# EAGLE design accel-chain (EAGLE 6.5.0)
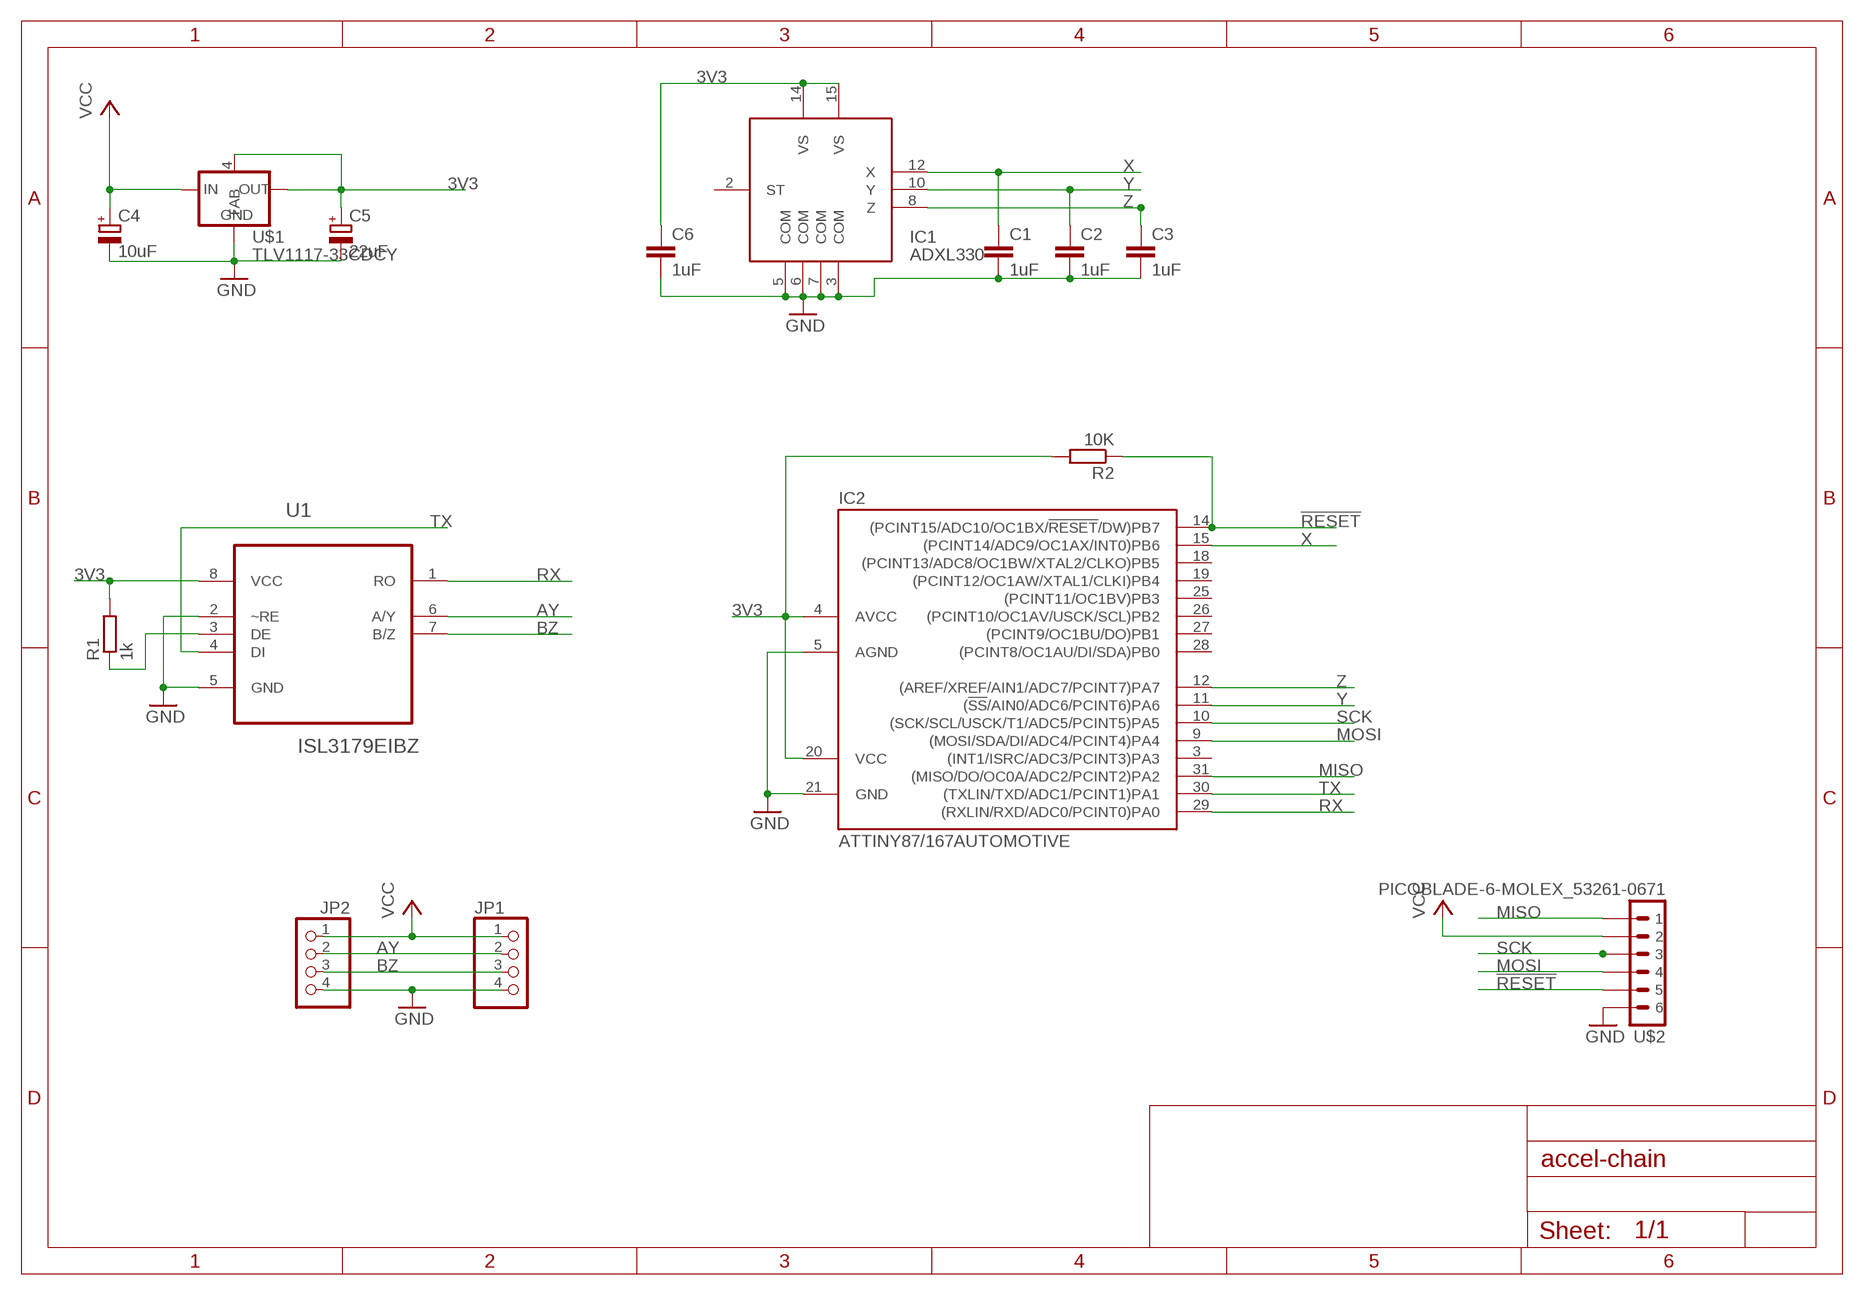
[diagram p0: schematic, sheet 1]

## Parts
C1  1uF  C-EUC0805  [C0805]
C2  1uF  C-EUC0805  [C0805]
C3  1uF  C-EUC0805  [C0805]
C4  10uF  CPOL-EUA/3216-18R  [A/3216-18R]
C5  22uF  CPOL-EUA/3216-18R  [A/3216-18R]
C6  1uF  C-EUC0805  [C0805]
IC1  ADXL330  [LFCSP16]
IC2  ATTINY87/167AUTOMOTIVE  [MLF32]
JP1  PINHD-1X4  [1X04]
JP2  PINHD-1X4  [1X04]
R1  1k  R-EU_R0805  [R0805]
R2  10K  R-EU_R0805  [R0805]
U1  ISL3179EIBZ  [SOIC127P600X175-8N]
U$1  TLV1117-33CDCY  [SOT223]
U$2  PICOBLADE-6-MOLEX_53261-0671  [PICOBLADE_6-MOLEX_53261-0671]

## Nets
3V3: C5.+ C6.1 IC1.14(VS) IC1.15(VS) IC2.4(AVCC) IC2.20(VCC) R1.2 R2.2 U1.8(VCC) U$1.2(OUT) U$1.4(TAB)
!RESET: IC2.14((PCINT15/ADC10/OC1BX/!RESET!/DW)PB7) R2.1 U$2.5
AY: JP1.2 JP2.2 U1.6(A/Y)
BZ: JP1.3 JP2.3 U1.7(B/Z)
GND: C1.2 C2.2 C3.2 C4.- C5.- C6.2 IC1.3(COM) IC1.5(COM) IC1.6(COM) IC1.7(COM) IC2.5(AGND) IC2.21(GND) JP1.4 JP2.4 U1.2(~RE) U1.5(GND) U$1.1(GND) U$2.6
MISO: IC2.31((MISO/DO/OC0A/ADC2/PCINT2)PA2) U$2.1
MOSI: IC2.9((MOSI/SDA/DI/ADC4/PCINT4)PA4) U$2.4
N$1: R1.1 U1.3(DE)
RX: IC2.29((RXLIN/RXD/ADC0/PCINT0)PA0) U1.1(RO)
SCK: IC2.10((SCK/SCL/USCK/T1/ADC5/PCINT5)PA5) U$2.3
TX: IC2.30((TXLIN/TXD/ADC1/PCINT1)PA1) U1.4(DI)
VCC: C4.+ JP1.1 JP2.1 U$1.3(IN) U$2.2
X: C1.1 IC1.12(X) IC2.15((PCINT14/ADC9/OC1AX/INT0)PB6)
Y: C2.1 IC1.10(Y) IC2.11((!SS!/AIN0/ADC6/PCINT6)PA6)
Z: C3.1 IC1.8(Z) IC2.12((AREF/XREF/AIN1/ADC7/PCINT7)PA7)
Unconnected: IC1.2(ST) IC2.3((INT1/ISRC/ADC3/PCINT3)PA3) IC2.18((PCINT13/ADC8/OC1BW/XTAL2/CLKO)PB5) IC2.19((PCINT12/OC1AW/XTAL1/CLKI)PB4) IC2.25((PCINT11/OC1BV)PB3) IC2.26((PCINT10/OC1AV/USCK/SCL)PB2) IC2.27((PCINT9/OC1BU/DO)PB1) IC2.28((PCINT8/OC1AU/DI/SDA)PB0)

## Library data of the parts
C1-C3 C6 = resistor:C-EU: CAPACITOR, European symbol
C4 C5 = resistor:CPOL-EU: POLARIZED CAPACITOR, European symbol
IC1 = basestation:ADXL330: ADXL330 3-Axis +/- 3g accelerometer centre pad for mechanical stability only; no electrical connection
IC2 = attiny87_167_automotive:ATTINY87/167AUTOMOTIVE
JP1 JP2 = pinhead:PINHD-1X4: PIN HEADER
R1 R2 = resistor:R-EU_: RESISTOR, European symbol
U1 = glacsweb:ISL3179EIBZ: TRANCEIVER; MPN: ISL3179EIBZ; OC_FARNELL: 1439860; OC_NEWARK: 58M7513; PACKAGE: SOIC-8; SUPPLIER: Intersil
U$1 = basestation:TLV1117-33CDCY: Texas Instruments 3.3v 800mA Voltage Regulator http://uk.farnell.com/texas-instruments/tlv1117-33cdcy/v-reg-ldo-3-3v-0-8a-sot-223-4/dp/1494942 Datasheet: http://focus.ti.com/lit/ds/symlink/tlv1117-33.pdf
U$2 = glacsweb:PICOBLADE-6; MANUFACTURER: Molex; MPN: 53261-0671; OC_FARNEL: 1125375; PACKAGE: SMT, SIDE

## Board
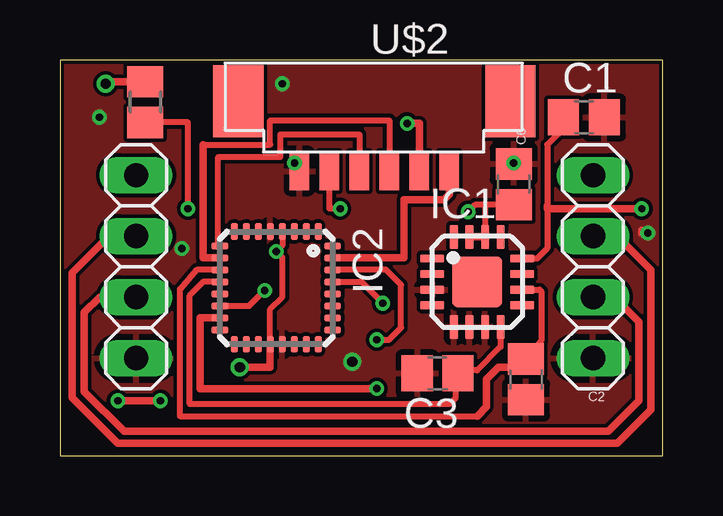
[diagram p1: board, top side]
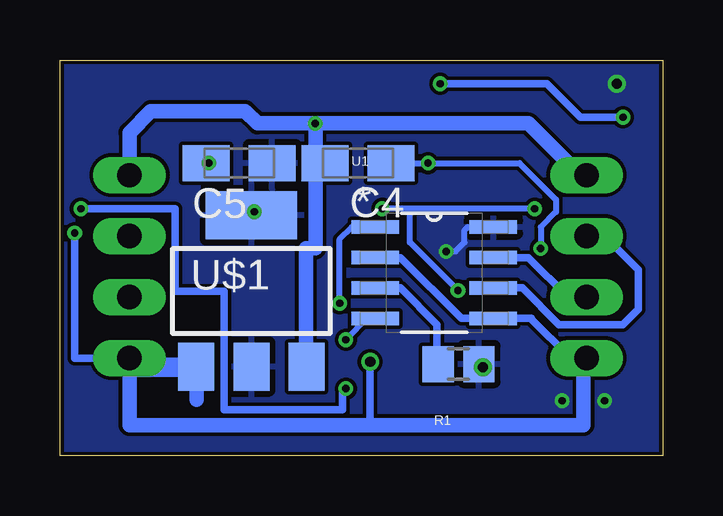
[diagram p2: board, bottom side, seen from below]

Size 25.13 x 16.48 mm. Coordinates in mm from the lower left corner, seen from the top.
Outline: 0,0 25.13,0 25.13,16.48 0,16.48 0,0
Copper layers (1*16): Top 0.035mm / dielectric 1.5mm / Bottom 0.035mm
Design rules "Hackvana": minimum track width 6mil, minimum drill 0.3mm, track to track 6mil, track to pad 6mil, pad to pad 6mil, via to via 6mil, smd to smd 0mil, copper to edge 6mil, drill to drill 6mil, minimum pad ring 10mil, minimum via ring 6mil, stop-mask expansion 2mil, vias tented up to drill 100mil, thermal gap 10mil

### Footprints (pad centres in the part's own frame; a part is rotated, then mirrored left to right if it is on the bottom)
C0805 = smd 1.3 x 1.5: 1 -0.85,0; 2 0.85,0
A/3216-18R = smd 1.95 x 1.5: + 1.375,0; - -1.375,0
LFCSP16 = smd 1 x 0.35: 1 -1.875,0.975; 2 -1.875,0.325; 3 -1.875,-0.325; 4 -1.875,-0.975; 9 1.875,-0.975; 10 1.875,-0.325; 11 1.875,0.325; 12 1.875,0.975 | smd 0.35 x 1: 5 -0.975,-1.875; 6 -0.325,-1.875; 7 0.325,-1.875; 8 0.975,-1.875; 13 0.975,1.875; 14 0.325,1.875; 15 -0.325,1.875; 16 -0.975,1.875 | smd 2.1 x 2.1: EXP 0,0
MLF32 = smd 0.7 x 0.3: 1 -2.35,1.75; 2 -2.35,1.25; 3 -2.35,0.75; 4 -2.35,0.25; 5 -2.35,-0.25; 6 -2.35,-0.75; 7 -2.35,-1.25; 8 -2.35,-1.75; 17 2.35,-1.75; 18 2.35,-1.25; 19 2.35,-0.75; 20 2.35,-0.25; 21 2.35,0.25; 22 2.35,0.75; 23 2.35,1.25; 24 2.35,1.75 | smd 0.3 x 0.7: 9 -1.75,-2.35; 10 -1.25,-2.35; 11 -0.75,-2.35; 12 -0.25,-2.35; 13 0.25,-2.35; 14 0.75,-2.35; 15 1.25,-2.35; 16 1.75,-2.35; 25 1.75,2.35; 26 1.25,2.35; 27 0.75,2.35; 28 0.25,2.35; 29 -0.25,2.35; 30 -0.75,2.35; 31 -1.25,2.35; 32 -1.75,2.35
1X04 = drill 1.016 long: 1 -3.81,0; 2 -1.27,0; 3 1.27,0; 4 3.81,0
R0805 = smd 1.3 x 1.5: 1 -0.85,0; 2 0.85,0
SOIC127P600X175-8N = smd 1.981 x 0.559: 1 -2.464,1.905; 2 -2.464,0.635; 3 -2.464,-0.635; 4 -2.464,-1.905; 5 2.464,-1.905; 6 2.464,-0.635; 7 2.464,0.635; 8 2.464,1.905
SOT223 = smd 1.5 x 2: 1 -2.3,-3.15; 2 0,-3.15; 3 2.3,-3.15 | smd 3.8 x 2: 4 0,3.15
PICOBLADE_6-MOLEX_53261-0671 = smd 0.8 x 1.6: 1 -2.77,1.73; 2 -1.52,1.73; 3 -0.27,1.73; 4 0.98,1.73; 5 2.23,1.73; 6 3.48,1.73 | smd 2.1 x 3: MOUNT1 -5.32,-1.17; MOUNT2 6.03,-1.17

### Placement (x,y rotation side)
C1  21.84,14.1 0 top
C2  19.43,3.18 270 top
C3  15.75,3.43 180 top
C4  12.7,12.19 180 bottom
C5  17.65,12.19 0 bottom
C6  18.92,11.3 90 top
IC1  17.4,7.24 0 top
IC2  9.02,6.99 270 top
JP1  22.22,7.87 270 top
JP2  3.17,7.87 270 top
R1  8.51,3.81 0 bottom
R2  3.56,14.73 90 top
U1  9.53,7.62 0 bottom
U$1  17.14,6.86 0 bottom
U$2  13.46,13.59 180 top

### Tracks (layer width: path | path; a pad name or v marks a point on that pad's centre or on a via)
3V3  (via drill 0.3, 0.43)
  Top 0.254: IC2.4 9.27,8.76 v9.02,8.51 9.27,8.26 9.27,6.6 8.77,6.1 IC2.20 | C6.1 17.72,10.45 | 17.72,10.45 IC1.14 | 17.72,10.45 17.31,10.45 v17.02,10.16
  Top 0.305: IC1.14 IC1.15 | v7.49,3.68 8.76,3.68 IC2.20 | R2.2 1.99,15.58 v1.91,15.49 | IC2.4 | v2.41,2.29 v4.19,2.29
  Bottom 0.254: v9.02,8.51 8.64,8.51 8.26,8.89 8.26,9.4 8.13,9.53 U1.8 | v17.02,10.16 17.14,10.16 U$1.4
  Bottom 0.305: v7.49,3.68 7.66,3.68 R1.2
  pour Bottom: -1.27,18.16 25.78,18.03 26.16,-1.14 -0.89,-1.02
!RESET  (via drill 0.3)
  Top 0.254: IC2.14 7.89,6.24 v8.53,6.88 | v11.68,10.29 11.23,10.29 U$2.5 | v5.33,10.29 5.33,13.88 R2.1
  Bottom 0.254: v5.33,10.29 10.54,10.29 | 10.54,10.29 v11.68,10.29 | v8.53,6.88 10.54,8.89 10.54,10.29
AY
  Top 0.305: JP1.2 23.24,9.14 24.64,7.75 24.64,1.9 23.24,0.51 2.41,0.51 0.51,2.41 0.51,7.62 2.03,9.14 JP2.2
  Bottom 0.305: U1.6 5.84,6.99 4.32,5.46 1.65,5.46 1.02,6.1 1.02,7.75 2.41,9.14 JP2.2
BZ
  Top 0.305: JP2.3 1.65,6.6 1.02,5.97 1.02,2.67 2.67,1.02 22.86,1.02 24.13,2.29 24.13,5.59 23.11,6.6 JP1.3
  Bottom 0.305: JP2.3 3.94,6.6 5.59,8.26 U1.7
GND  (via drill 0.3, 0.43)
  Top 0.305: v24.51,9.27 24.26,9.27 24.26,9.4
  Bottom 0.254: C4.- v9.78,12.19 5.97,12.19 4.45,10.67 4.45,10.16 5.08,9.53 v5.08,8.64 | v18.92,12.19 C5.-
  Bottom 0.305: U1.2 10.92,8.26 8.38,5.71 U1.5 5.46,5.71 5.46,5.69 3.89,4.12 3.23,4.12 JP2.4 | v12.19,3.91 12.19,1.27 | JP1.4 24.51,4.06 v24.51,9.27 | v9.27,15.49 4.83,15.49 3.43,14.1 v1.65,14.1
  Bottom 0.61: C2.2 19.43,3.69 U$1.1 | JP2.4 3.3,4.06 3.3,1.27 12.19,1.27 22.22,1.27 JP1.4
  Bottom 0.813: U$1.1 19.43,3.68 21.84,3.68 JP1.4
  pour Top: -2.54,19.05 26.92,19.05 27.18,-1.65 -2.29,-1.65
MISO
  Top 0.305: IC2.31 11.37,8.26 14.35,8.26 14.35,10.67 16,10.67 16.23,10.9 U$2.1
MOSI
  Top 0.254: 12.45,11.82 U$2.4 12.48,13.39 9.2,13.39 9.2,12.45 6.6,12.45 6.6,8.74 IC2.9
N$1
  Bottom 0.305: U1.3 10.92,6.99 9.4,5.46 9.4,3.85 R1.1
RX  (via drill 0.3)
  Top 0.254: IC2.29 12.58,7.24 v13.46,6.35
  Bottom 0.254: v13.46,6.35 13.46,9.02 12.95,9.53 U1.1
SCK
  Top 0.254: 5.97,12.95 8.76,12.95 8.76,13.97 13.73,13.97 U$2.3
  Top 0.305: IC2.10 5.97,8.24 5.97,12.95
TX  (via drill 0.3)
  Top 0.254: v13.21,4.83 13.72,4.83 14.22,5.33 14.22,7.11 13.59,7.75 11.38,7.75 IC2.30
  Bottom 0.254: U1.4 12.32,5.71 v13.21,4.83
VCC  (via drill 0.3)
  Top 0.305: U$2.2 14.98,13.84 v14.48,13.84
  Bottom 0.61: U$1.3 14.86,3.71 14.86,8.64 14.48,8.64 14.48,11.79 | 14.48,11.79 C4.+ | JP2.1 3.43,11.68 5.59,13.84 v14.48,13.84 | v14.48,13.84 16.89,13.84 17.4,14.35 21.34,14.35 22.22,13.46 JP1.1 | 14.48,11.79 v14.48,13.84
X  (via drill 0.3)
  Top 0.254: C1.1 20.99,13.63 20.32,12.95 20.32,10.41 20.32,8.64 19.89,8.2 IC1.12
  Top 0.305: IC2.15 5.84,5.74 5.84,2.79 v13.21,2.79 | v24.26,10.29 20.32,10.29 20.32,10.41
  Bottom 0.305: v13.21,2.79 13.34,2.79 13.34,1.9 18.29,1.9 18.29,6.86 20.32,6.86 20.32,10.29 v24.26,10.29
Y
  Top 0.254: IC2.11 5.7,7.74 5,6.93 5,1.65 17.4,1.65 | C2.1 20.07,4.79 20.07,6.86 20.01,6.91 IC1.10
  Top 0.305: 17.4,1.65 17.78,2.03 17.78,3.18 18.29,3.68 19.09,3.68 C2.1
Z
  Top 0.254: IC2.12 5.96,7.24 5.41,6.68 5.41,2.16 16.26,2.16 16.51,2.41 16.51,3.34 | IC1.8 18.37,4.53 17.4,3.56 16.72,3.56 C3.1
  Top 0.305: 16.51,3.34 C3.1

### Text on the board
tDocu: V0.1 | accel-chain